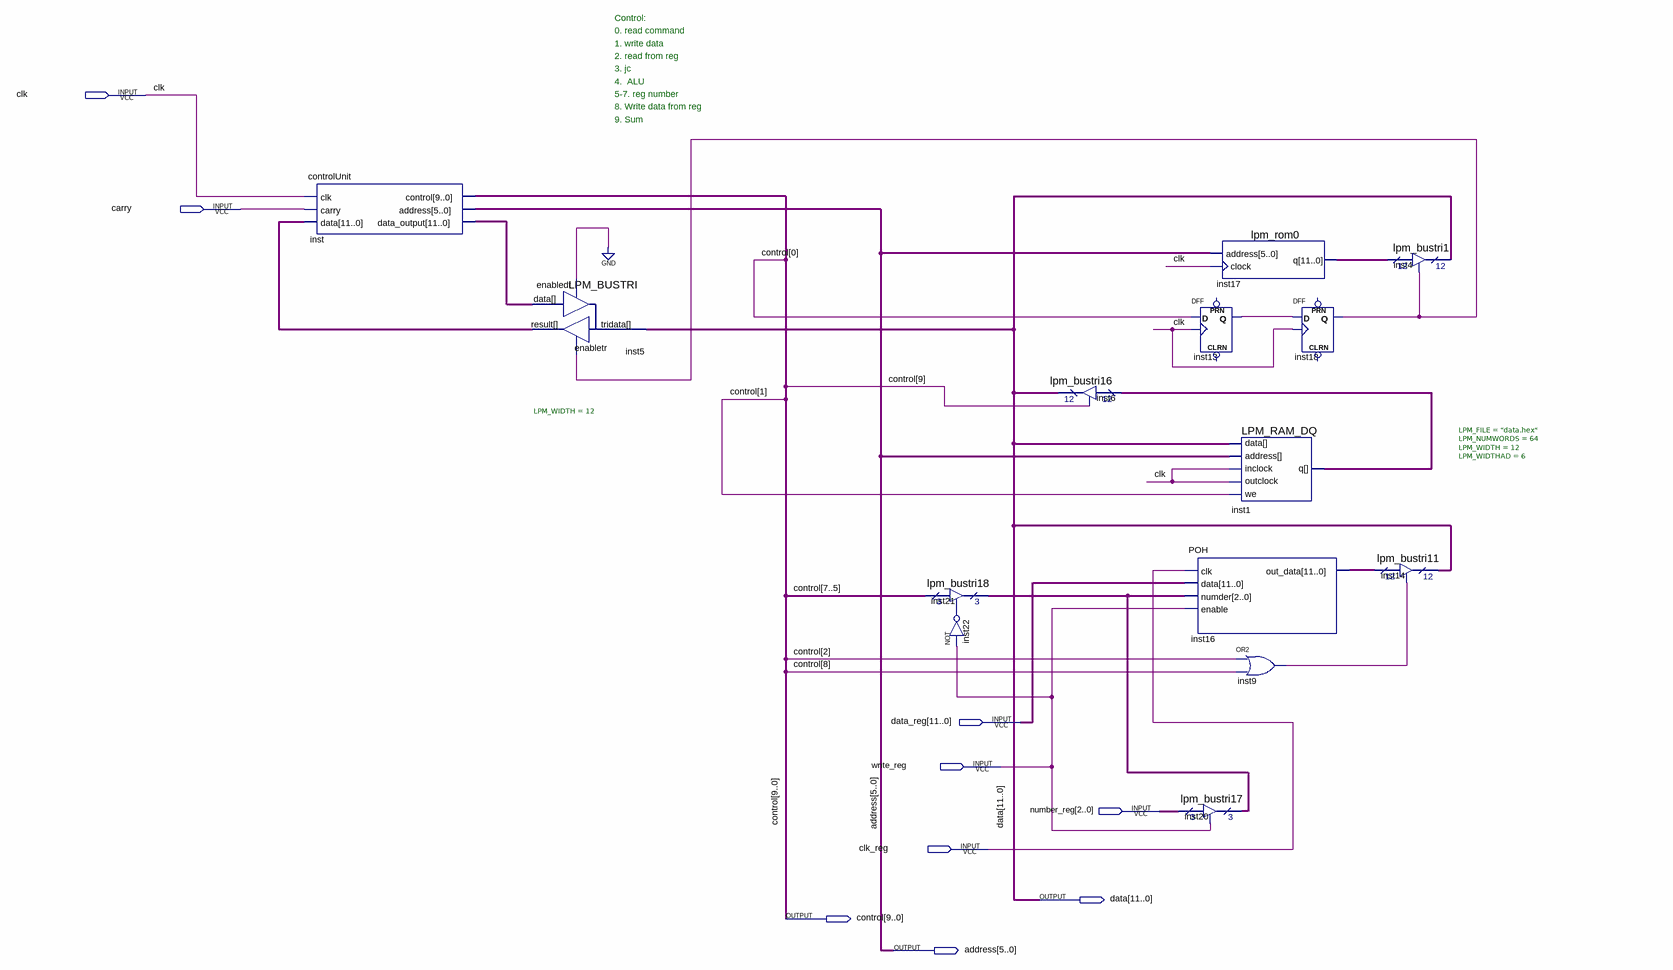
[diagram p0: schematic sheet]
// Quartus schematic main.bdf as structural Verilog: 14 symbols, 9 pins
module main (
  input  clk,
  input  carry,
  input  [11:0] data_reg,
  input  write_reg,
  input  [2:0] number_reg,
  input  clk_reg,
  output [11:0] data,
  output [9:0] control,
  output [5:0] address
);

  wire inst9_out, inst13_q, inst18_q, inst22_out;
  wire [2:0] inst21_tridata;
  wire [11:0] inst1_q, inst5_result, inst16_out_data, inst17_q, inst_data_output;

  controlUnit inst (
    .clk(clk), .carry(carry), .data(inst5_result), .control(control), .address(address),
    .data_output(inst_data_output));
  LPM_BUSTRI #(.LPM_WIDTH(12)) inst5 (
    .data(inst_data_output), .enabledt(1'b0), .enabletr(inst18_q), .result(inst5_result), .tridata(data));
  lpm_bustri18 inst21 (.enabledt(inst22_out), .data(control[7:5]), .tridata(inst21_tridata));
  not inst22 (inst22_out, write_reg);
  lpm_bustri16 inst6 (.enabledt(control[9]), .data(inst1_q), .tridata(data));
  lpm_rom0 inst17 (.address(address), .clock(clk), .q(inst17_q));
  DFF inst13 (.CLK(clk), .D(control[0]), .Q(inst13_q));  // open: CLRN, PRN
  POH inst16 (.clk(clk_reg), .data(data_reg), .numder(inst21_tridata), .enable(write_reg), .out_data(inst16_out_data));
  lpm_bustri17 inst20 (.enabledt(write_reg), .data(number_reg), .tridata(inst21_tridata));
  LPM_RAM_DQ #(.LPM_FILE("data.hex"), .LPM_NUMWORDS(64), .LPM_WIDTH(12), .LPM_WIDTHAD(6)) inst1 (
    .inclock(clk), .data(data), .address(address), .we(control[1]), .outclock(clk), .q(inst1_q));
  or inst9 (inst9_out, control[2], control[8]);
  DFF inst18 (.CLK(clk), .D(inst13_q), .Q(inst18_q));  // open: CLRN, PRN
  lpm_bustri11 inst14 (.enabledt(inst9_out), .data(inst16_out_data), .tridata(data));
  lpm_bustri1 inst4 (.enabledt(inst18_q), .data(inst17_q), .tridata(data));

  // Notes on the sheet:
  //   Control:
  //   0. read command
  //   1. write data
  //   2. read from reg
  //   3. jc
  //   4.
  //   ALU
  //   5-7. reg number
  //   8. Write data from reg
  //   9. Sum
endmodule
